# Altium schematic sheet Screen.SchDoc
size A4; SheetNumber: 4
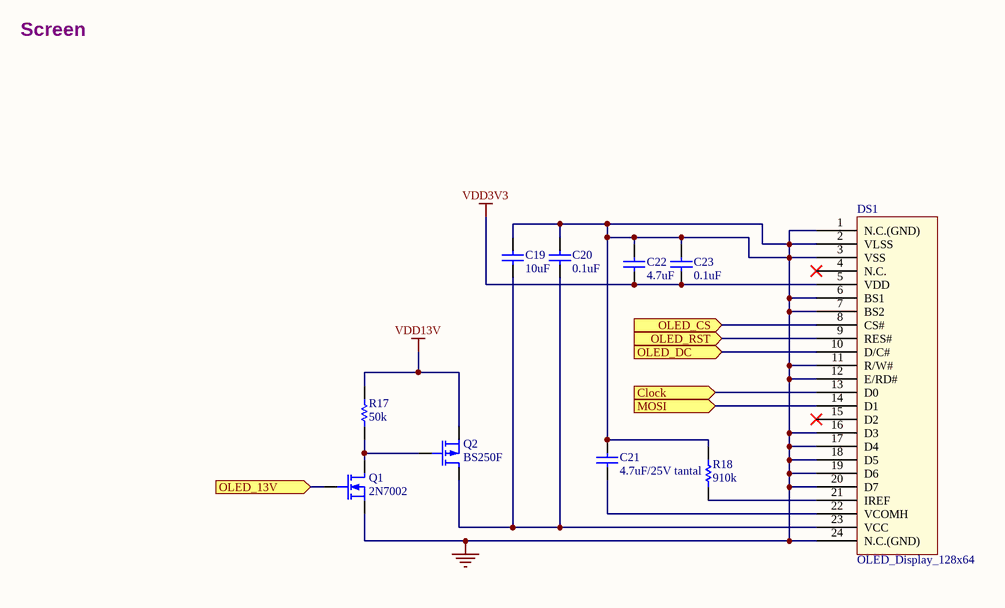
[diagram p0: Screen.SchDoc]

## Parts
C19  10uF  [CAPC1608X90N]
C20  0.1uF  [CAPC1608X90N]
C21  4.7uF/25V tantal  [CAPMP3216X180N]
C22  4.7uF  [CAPC2012X135N]
C23  0.1uF  [CAPC2012X135N]
DS1  OLED_Display_128x64  [HRS_FH12-24S-0.5SH(55)]
Q1  2N7002  [SOT23-3]
Q2  BS250F  [SOT23-3]
R17  50k  [RESC1608X55N]
R18  910k  [RESC1608X55N]

## Ports
Clock (in), MOSI (in), OLED_13V (in), OLED_CS (in), OLED_DC (in), OLED_RST (in)

## Nets
GND: C19.2 C20.1 C21.1 C22.2 C23.1 DS1.1(N.C.(GND)) DS1.2(VLSS) DS1.3(VSS) DS1.6(BS1) DS1.7(BS2) DS1.11(R/W#) DS1.12(E/RD#) DS1.16(D3) DS1.17(D4) DS1.18(D5) DS1.19(D6) DS1.20(D7) DS1.24(N.C.(GND)) Q1.2(S) R18.1
VDD3V3: C22.1 C23.2 DS1.5(VDD)
VDD13V: Q2.2(S) R17.2
Clock: DS1.13(D0) ; port Clock
MOSI: DS1.14(D1) ; port MOSI
OLED_13V: Q1.1(G) ; port OLED_13V
OLED_CS: DS1.8(CS#) ; port OLED_CS
OLED_DC: DS1.10(D/C#) ; port OLED_DC
OLED_RST: DS1.9(RES#) ; port OLED_RST
NetC19_1: C19.1 C20.2 DS1.23(VCC) Q2.3(D)
NetC21_2: C21.2 DS1.22(VCOMH)
NetDS1_21: DS1.21(IREF) R18.2
NetQ1_3: Q1.3(D) Q2.1(G) R17.1

Not connected (* = marked no-connect by the designer): DS1 4(N.C.)* 15(D2)*

## Notes on the sheet
- Screen

## Library data of the parts
C19 C20 C22 C23 = Capacitor: Fabricant: MURATA; Fournisseur: Farnell
C21 = Capacitor: Fabricant: KEMET; Fournisseur: Farnell; Fournisseur_REF: 2283561; Fabricant_REF: T491D476K025AT; Price: 0.332
DS1 = OLED_Display_128x64: Fabricant: MIDAS; Fabricant_REF: MCOT128064H1V-WM; Fournisseur: Farnell; Fournisseur_REF: 2817924; Price: 18.81
Q1 = MOSFET-N: N-Channel MOSFET; Fabricant: NEXPERIA; Fournisseur: Farnell; Fournisseur_REF: 1859847; Fabricant_REF: 2N7002BK; Price: 0.196
Q2 = MOSFET-P: P-Channel MOSFET; Fabricant: DIODES INC; Fournisseur: Farnell; Fournisseur_REF: 1843731; Fabricant_REF: BS250FTA; Price: 0.539
R17 R18 = Resistor: Fabricant: MULTICOMP; Fournisseur: Farnell